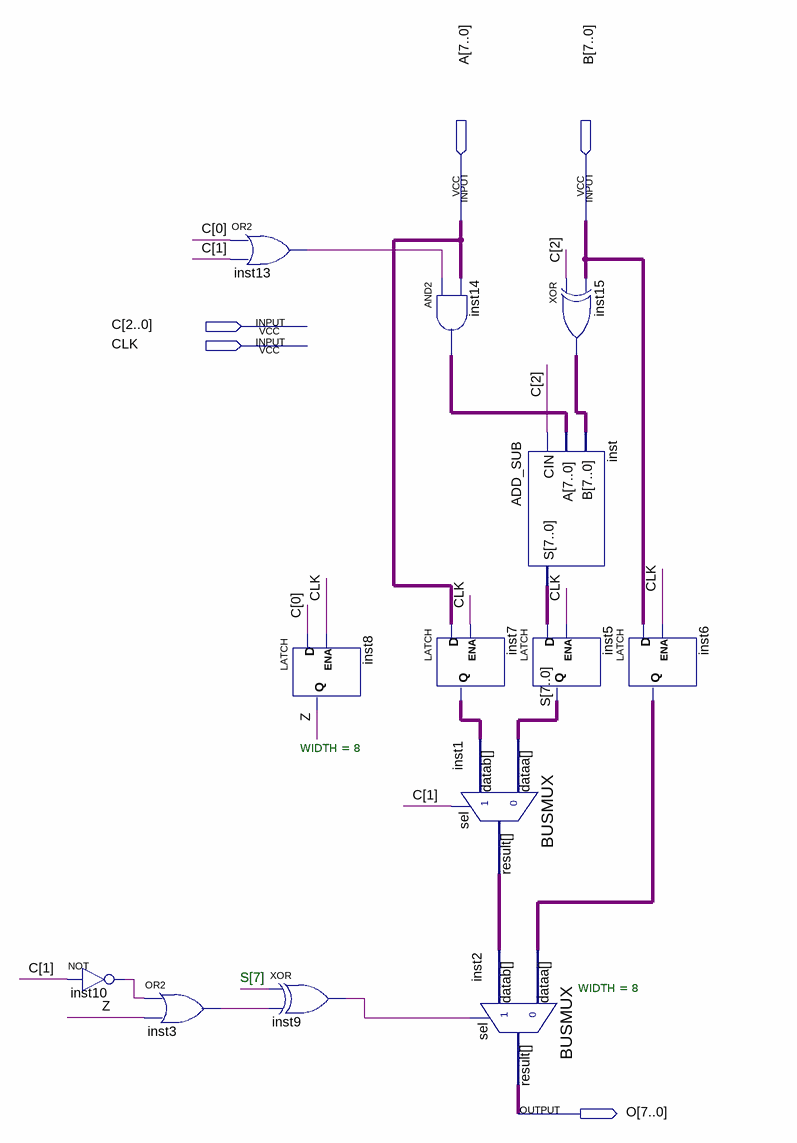
[diagram p0: schematic sheet]
// Quartus schematic ALU.bdf as structural Verilog: 13 symbols, 5 pins
module ALU (
  input  [7:0] A,
  input  [7:0] B,
  input  [2:0] C,
  input  CLK,
  output [7:0] O
);

  wire inst3_out, inst9_out, inst10_out, inst13_out, Z;
  wire [7:0] inst1_result, inst6_q, inst7_q, inst14_out, inst15_out, inst_s, S;

  not inst10 (inst10_out, C[1]);
  or inst3 (inst3_out, inst10_out, Z);
  or inst13 (inst13_out, C[0], C[1]);
  LATCH inst8 (.D(C[0]), .ENA(CLK), .Q(Z));
  xor inst9 (inst9_out, S[7], inst3_out);
  assign inst14_out = {8{inst13_out}} & A;  // AND2 inst14, 8 bits wide
  LATCH inst7[7:0] (.D(A), .ENA(CLK), .Q(inst7_q));
  ADD_SUB inst (.CIN(C[2]), .A(inst14_out), .B(inst15_out), .S(inst_s));
  BUSMUX #(.WIDTH(8)) inst1 (.datab(inst7_q), .sel(C[1]), .dataa(S), .result(inst1_result));
  BUSMUX #(.WIDTH(8)) inst2 (.datab(inst1_result), .sel(inst9_out), .dataa(inst6_q), .result(O));
  assign inst15_out = {8{C[2]}} ^ B;  // XOR inst15, 8 bits wide
  LATCH inst5[7:0] (.D(inst_s), .ENA(CLK), .Q(S));
  LATCH inst6[7:0] (.D(B), .ENA(CLK), .Q(inst6_q));

  // Notes on the sheet:
  //   S[7]
endmodule
